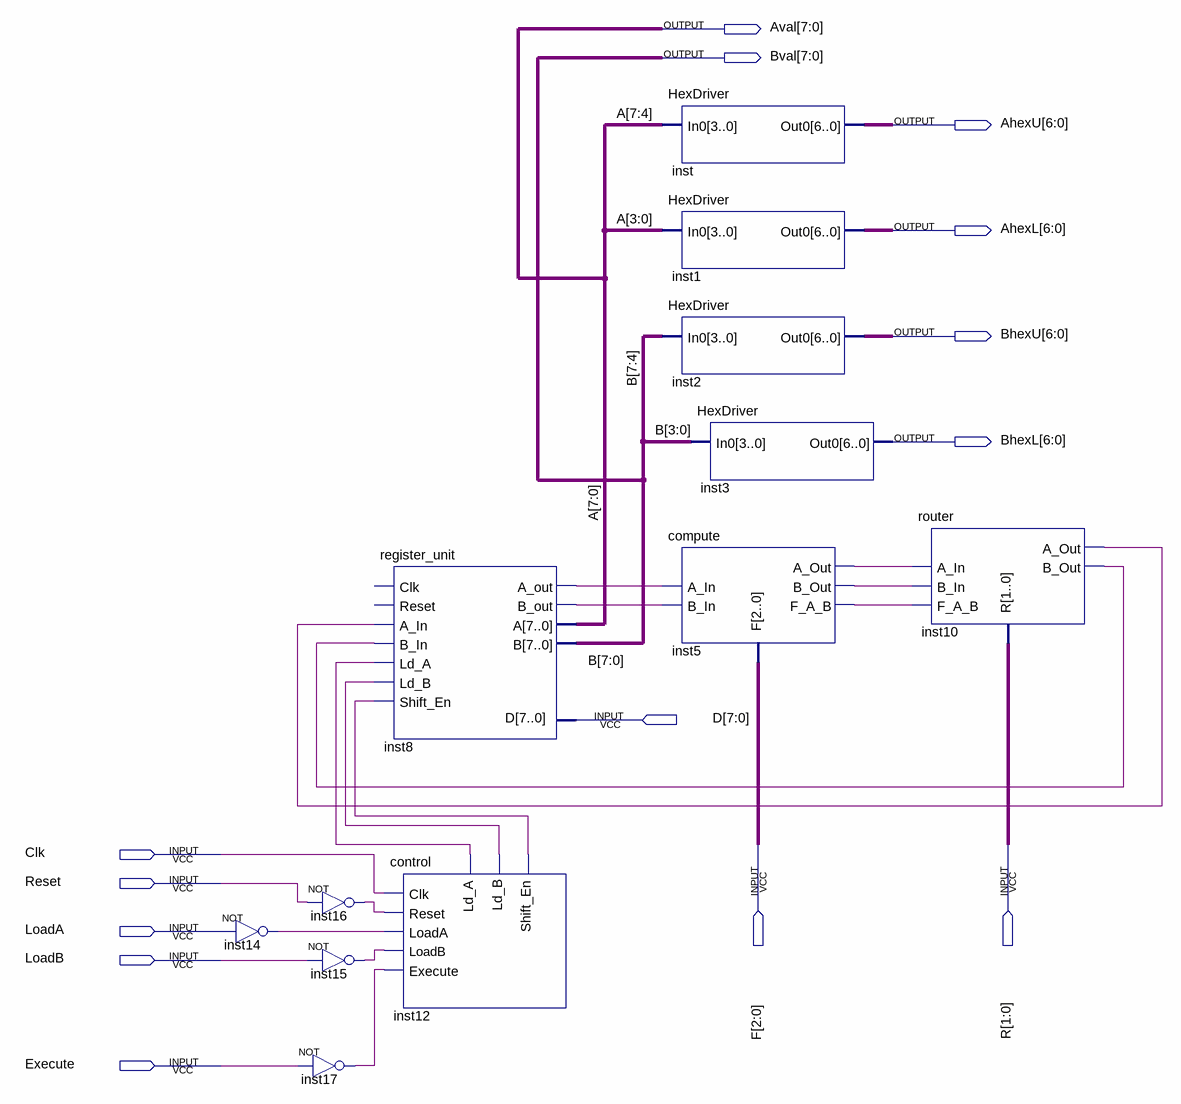
[diagram p0: schematic sheet]
// Quartus schematic logic_processor.bdf as structural Verilog: 12 symbols, 14 pins
module logic_processor (
  input  [7:0] D,
  input  [2:0] F,
  input  [1:0] R,
  input  Clk,
  input  Reset,
  input  LoadA,
  input  LoadB,
  input  Execute,
  output [7:0] Aval,
  output [7:0] Bval,
  output [6:0] AhexU,
  output [6:0] AhexL,
  output [6:0] BhexU,
  output [6:0] BhexL
);

  wire inst5_a_out, inst5_b_out, inst5_f_a_b, inst8_a_out, inst8_b_out, inst10_a_out, inst10_b_out,
       inst12_ld_a, inst12_ld_b, inst12_shift_en, inst14_out, inst15_out, inst16_out, inst17_out;

  not inst14 (inst14_out, LoadA);
  not inst16 (inst16_out, Reset);
  not inst15 (inst15_out, LoadB);
  not inst17 (inst17_out, Execute);
  register_unit inst8 (
    .A_In(inst10_a_out), .B_In(inst10_b_out), .Ld_A(inst12_ld_a), .Ld_B(inst12_ld_b),
    .Shift_En(inst12_shift_en), .D(D), .A_out(inst8_a_out), .B_out(inst8_b_out), .A(Aval), .B(Bval));  // open: Clk, Reset
  control inst12 (
    .Clk(Clk), .Reset(inst16_out), .LoadA(inst14_out), .LoadB(inst15_out), .Execute(inst17_out),
    .Shift_En(inst12_shift_en), .Ld_A(inst12_ld_a), .Ld_B(inst12_ld_b));
  HexDriver inst (.In0(Aval[7:4]), .Out0(AhexU));
  HexDriver inst1 (.In0(Aval[3:0]), .Out0(AhexL));
  HexDriver inst2 (.In0(Bval[7:4]), .Out0(BhexU));
  HexDriver inst3 (.In0(Bval[3:0]), .Out0(BhexL));
  compute inst5 (
    .F(F), .A_In(inst8_a_out), .B_In(inst8_b_out), .A_Out(inst5_a_out), .B_Out(inst5_b_out),
    .F_A_B(inst5_f_a_b));
  router inst10 (
    .R(R), .A_In(inst5_a_out), .B_In(inst5_b_out), .F_A_B(inst5_f_a_b), .A_Out(inst10_a_out),
    .B_Out(inst10_b_out));

  // Other names for the same wires on the sheet: A[7:0] = Aval; B[7:0] = Bval
endmodule
